# Altium schematic sheet STRWHL-S03-V00-IsolatedCAN.SchDoc: CANBUS
size A3; DrawnBy: Jonn Dillon; DocumentNumber: 3; Revision: 00; SheetNumber: 3; SheetTotal: 9; Project: Steering Wheel 2020; PageSetup: Record=PageOptions|CenterHorizontal=True|CenterVertical=True|PrintScale=0.97|XCorrection=1.00|YCorrection=1.00|PrintKind=0|BorderSize=5000000|LeftOffset=0|BottomOffset=0|Orientation=2|PaperLength=1000|PaperWidth=1000|Scale=100|PaperSource=7|PrintQuality=-4|MediaType=1|DitherType=10|PaperKind=A4|PrintScaleMode=1
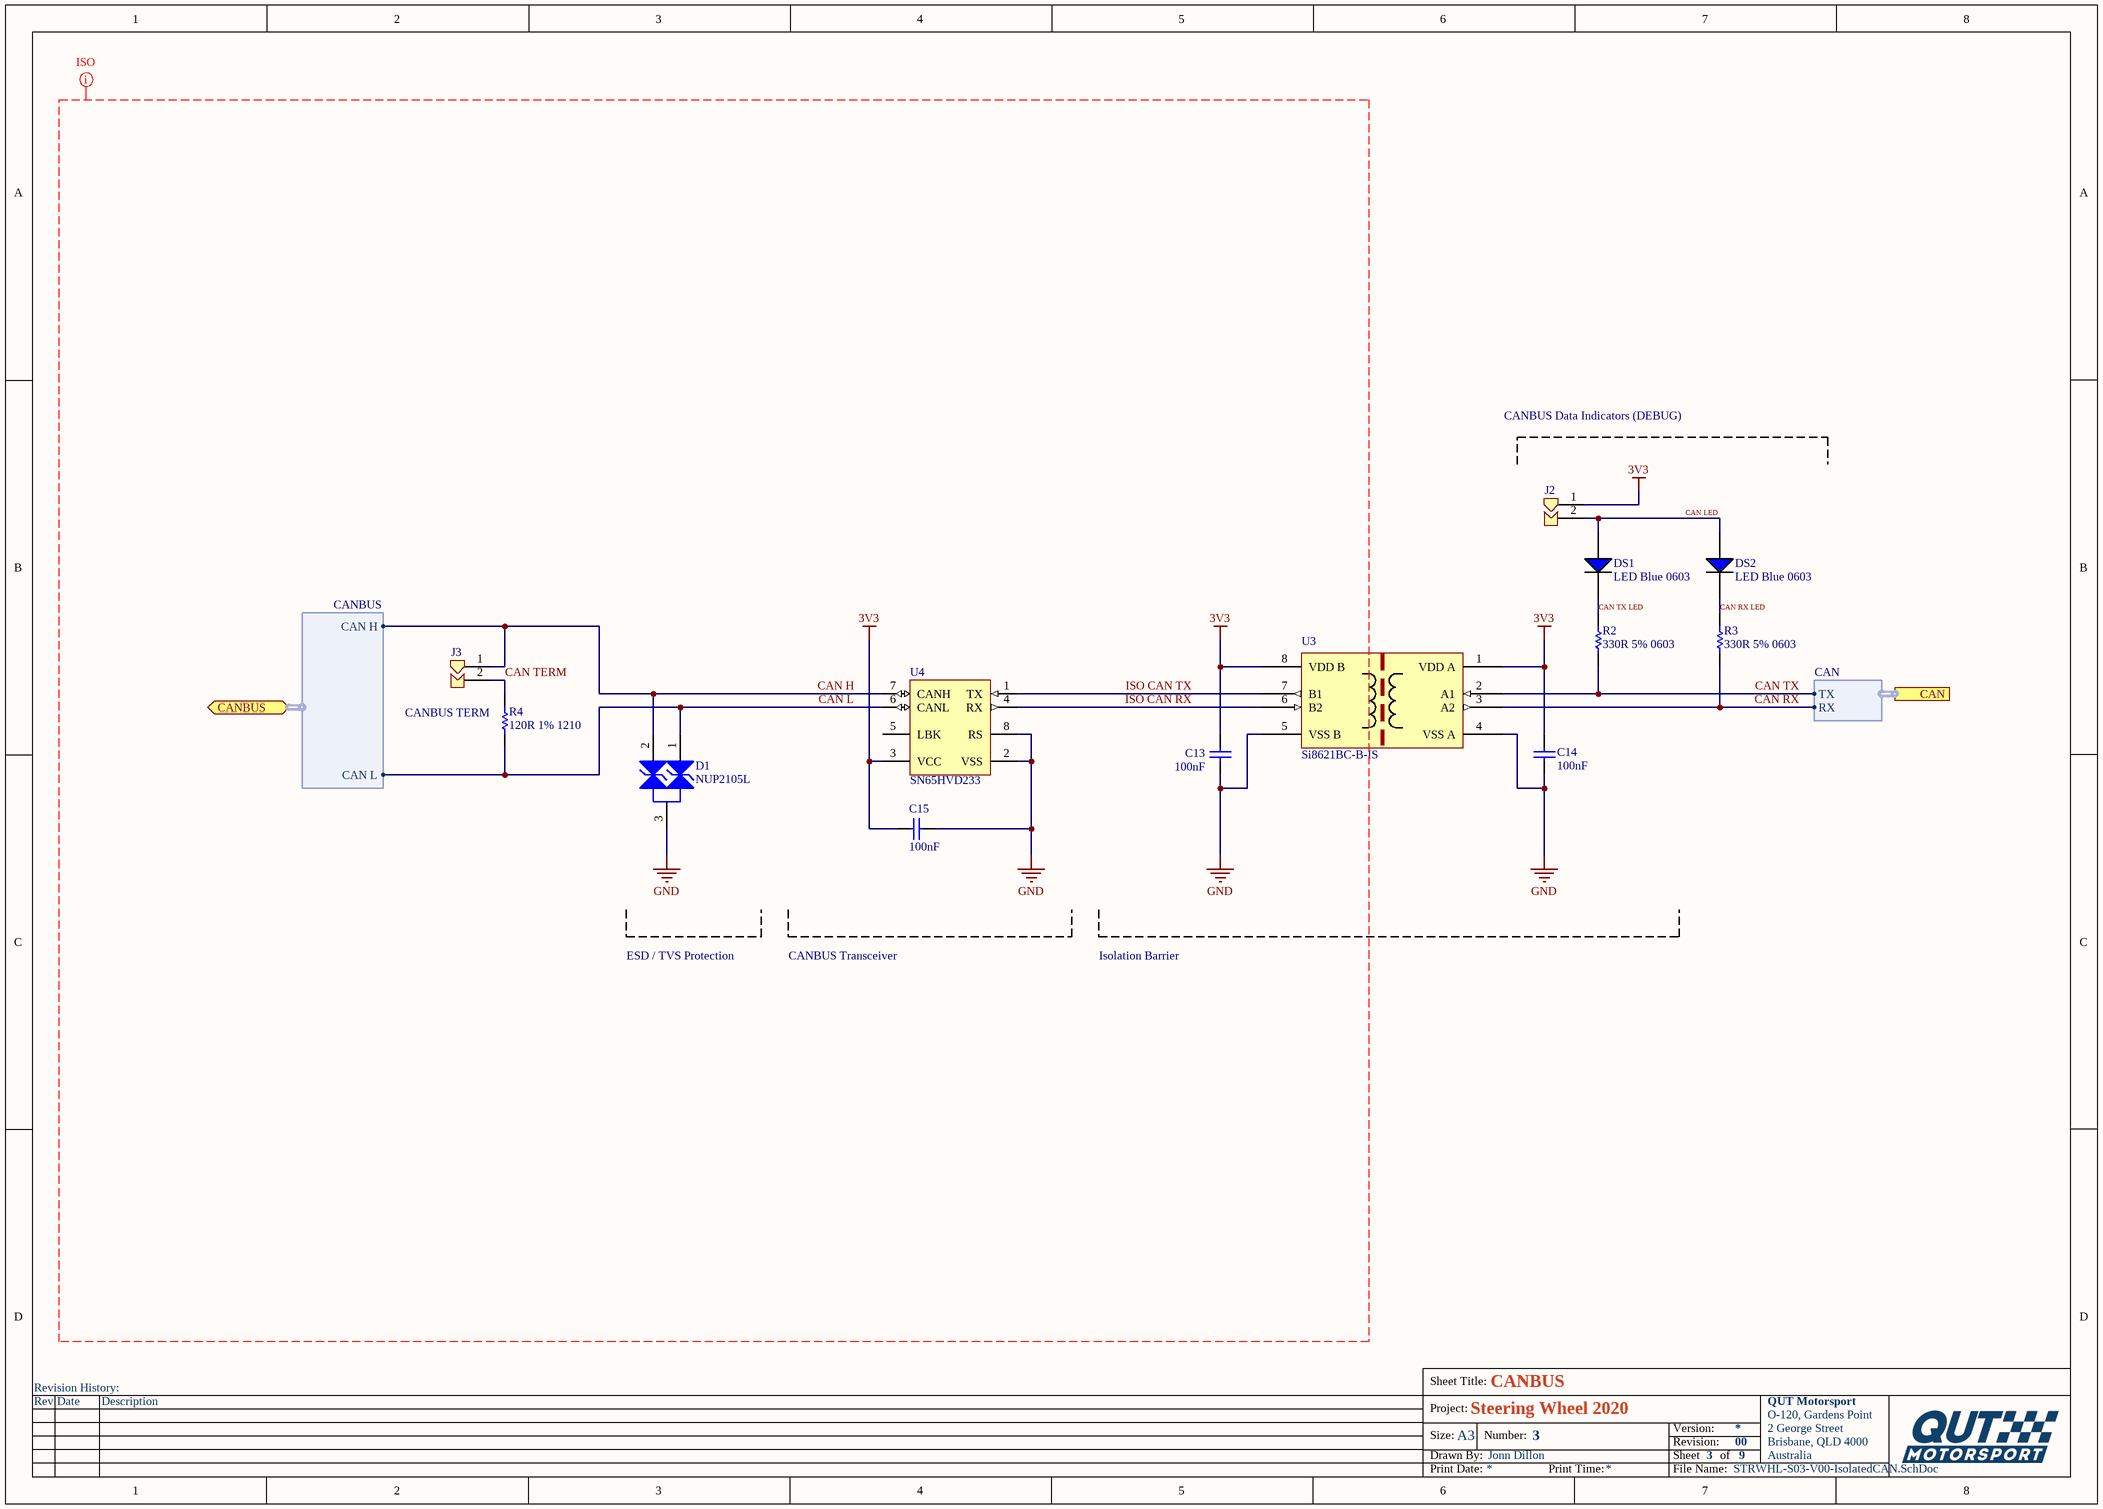
[diagram p0: STRWHL-S03-V00-IsolatedCAN.SchDoc]

## Parts
C13  100nF  [Cap_Ceramic_0603]
C14  100nF  [Cap_Ceramic_0603]
C15  100nF  [Cap_Ceramic_0603]
D1  NUP2105L  [NUP2105L]
DS1  LED Blue 0603  [LED BLUE 0603]
DS2  LED Blue 0603  [LED BLUE 0603]
J2  Jumper 2Way Solderable  [Jumper_2Way_Solderable]  (value not drawn)
J3  Jumper 2Way Solderable  [Jumper_2Way_Solderable]  (value not drawn)
R2  330R 5% 0603  [Res_ThinFilm_0603]
R3  330R 5% 0603  [Res_ThinFilm_0603]
R4  120R 1% 1210  [Res_ThinFilm_1210]
U3  Si8621BC-B-IS  [Si8621BC-B-IS]
U4  SN65HVD233  [SN65HVD233DR]

## Ports
CAN (harness CAN), CANBUS (bidir, harness CANBUS)

## Harnesses
CANBUS: CAN H, CAN L
CAN: RX, TX

## Nets
3V3: C13.2 C14.2 C15.2 J2.1 U3.1(VDD_A) U3.8(VDD_B) U4.3(VCC)
GND: C13.1 C14.1 C15.1 D1.3 U3.4(VSS_A) U3.5(VSS_B) U4.2(VSS) U4.8(RS)
CAN H: D1.2 J3.1 U4.7(CANH) ; port CANBUS.CAN H
CAN L: D1.1 R4.1 U4.6(CANL) ; port CANBUS.CAN L
CAN LED: DS1.1(A) DS2.1(A) J2.2
CAN RX: R3.1 U3.3(A2) ; port CAN.RX
CAN RX LED: DS2.2(C) R3.2
CAN TERM: J3.2 R4.2
CAN TX: R2.1 U3.2(A1) ; port CAN.TX
CAN TX LED: DS1.2(C) R2.2
ISO CAN RX: U3.6(B2) U4.4(RX)
ISO CAN TX: U3.7(B1) U4.1(TX)

Not connected (* = marked no-connect by the designer): U4 5(LBK)

## Layout directives
mark named ISO: 3V3, CAN H, CAN L, CAN TERM, GND, ISO CAN RX, ISO CAN TX

## Notes on the sheet
- CANBUS Data Indicators (DEBUG)
- (near R4) CANBUS TERM
- ESD / TVS Protection
- CANBUS Transceiver
- Isolation Barrier
- Revision History:
- Sheet Title:
- Rev
- Date
- Description
- Project:
- Size:
- Drawn By:
- A3
- Number:
- Revision:
- Sheet
- Version:
- of
- QUT Motorsport
- O-120, Gardens Point
- 2 George Street
- Brisbane, QLD 4000
- Australia
- Print Date:
- Print Time:
- File Name:

## Library data of the parts
C13-C15 = 100nF 50V 5% X7R 0603: Capacitor, Ceramic, SMD, 100nF, 50V, 5%, X7R, 0603
J2 J3 = Jumper 2Way Side Solderable
R2 R3 = 330R 5% 0603: Resistor, SMD, 330R, 0.1W, 5%, 0603
R4 = 120R 1% 1210: Resistor, SMD, 120R, 0.25W, 1%, 1210
D1 = NUP2105L: ComponentLink1Description: Datasheet; ComponentLink1URL: https://www.onsemi.cn/PowerSolutions/document/NUP2105L-D.PDF; Parameter 1: *; ComponentLink2Description: LCSC; ComponentLink2URL: https://lcsc.com/product-detail/TVS_ON-Semiconductor-NUP2105LT1G_C14486.html; ComponentLink3Description: Digikey; ComponentLink3URL: https://www.digikey.com.au/product-detail/en/on-semiconductor/SZNUP2105LT1G/SZNUP2105LT1GOSCT-ND/3487669
U3 = Si8621BC-B-IS: ComponentLink1Description: Digikey; ComponentLink1URL: https://www.digikey.com.au/product-detail/en/silicon-labs/SI8621BC-B-ISR/336-4774-1-ND/8611005; ComponentLink2Description: Datasheet; ComponentLink2URL: https://www.silabs.com/documents/public/data-sheets/si861x-2x-datasheet.pdf
U4 = SN65HVD233: ComponentLink1Description: LCSC; ComponentLink1URL: https://lcsc.com/product-detail/CAN-ICs_Texas-Instruments_SN65HVD233DRG4_Texas-Instruments-Texas-Instruments-SN65HVD233DRG4_C61643.html; ComponentLink2Description: Digikey; ComponentLink2URL: https://www.digikey.com.au/product-detail/en/texas-instruments/SN65HVD233DR/296-35967-1-ND/4134960; ComponentLink3Description: Datasheet; ComponentLink3URL: https://www.ti.com/lit/ds/symlink/sn65hvd233.pdf?ts=1588560888178; ComponentLink4Description: Ti Product Page; ComponentLink4URL: https://www.ti.com/product/SN65HVD233